# Altium schematic sheet tuch-tablotara.SchDoc
size A3
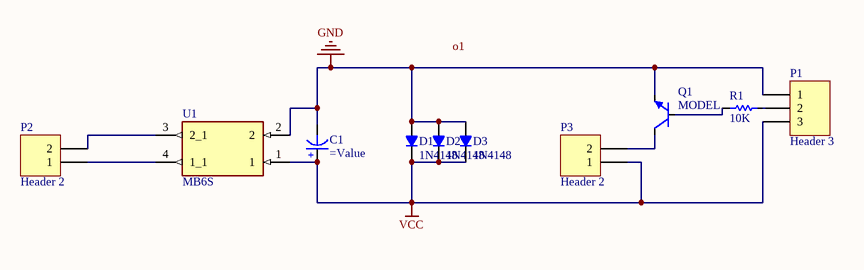
[diagram p0: tuch-tablotara.SchDoc]

## Parts
C1  (no value)  [ELEC-CAP-RAD10-20]
D1  MODEL: 1N4148  [DO-41]  (hidden comment: MODEL)
D2  MODEL: 1N4148  [DO-41]  (hidden comment: MODEL)
D3  MODEL: 1N4148  [DO-41]  (hidden comment: MODEL)
P1  Header 3  [HDR1X3]
P2  Header 2  [HDR1X2]
P3  Header 2  [HDR1X2]
Q1  MODEL  [SOT32]
R1  10K  [RES 1206 (3216X08L)]
U1  MB6S  [SOIC245P670X270-4N]

## Nets
GND: C1.1(-) D1.1(A) D2.1(A) D3.1(A) P1.1 Q1.1(E) U1.2
VCC: C1.2(+) D1.2(K) D2.2(K) D3.2(K) P1.3 P3.1 U1.1
NetP1_2: P1.2 R1.1
NetP2_1: P2.1 U1.4(1_1)
NetP2_2: P2.2 U1.3(2_1)
NetP3_2: P3.2 Q1.2(C)
NetQ1_3: Q1.3(B) R1.2

## Notes on the sheet
- Labels drawn without touching a wire or pin: o1

## Library data of the parts
C1 = Capacitor Electrolytic: Electrolytic Capacitor
D1-D3 = Diode
P1 = Header 3: Header, 3-Pin; LatestRevisionDate: 17-Jul-2002; LatestRevisionNote: Re-released for DXP Platform.; Publisher: Altium Limited
P2 P3 = Header 2: Header, 2-Pin; LatestRevisionDate: 17-Jul-2002; LatestRevisionNote: Re-released for DXP Platform.; Publisher: Altium Limited
Q1 = BD139: NPN Bipolar Transistor
R1 = Resistor: Tolerance: 5%; Power: 1/4 W; Value: 10K
U1 = MB6S: Bridge Rectifier Single Phase Standard 600V Surface Mount 4-SOIC; MF: ON Semiconductor; Digi-Key_Purchase_URL: https://www.digikey.com.tr/product-detail/en/on-semiconductor/MB6S/MB6SCT-ND/965654?utm_source=snapeda&utm_medium=aggregator&utm_campaign=symbol; Value: *; Package: BESOP-4 Surge Components; Digi-Key_Part_Number: MB6SCT-ND; SnapEDA_Link: https://www.snapeda.com/parts/MB6S/ON%20Semiconductor/view-part/2774209/?ref=snap; MP: MB6S